# Altium schematic sheet DCMotor2CTRL.SchDoc
size B
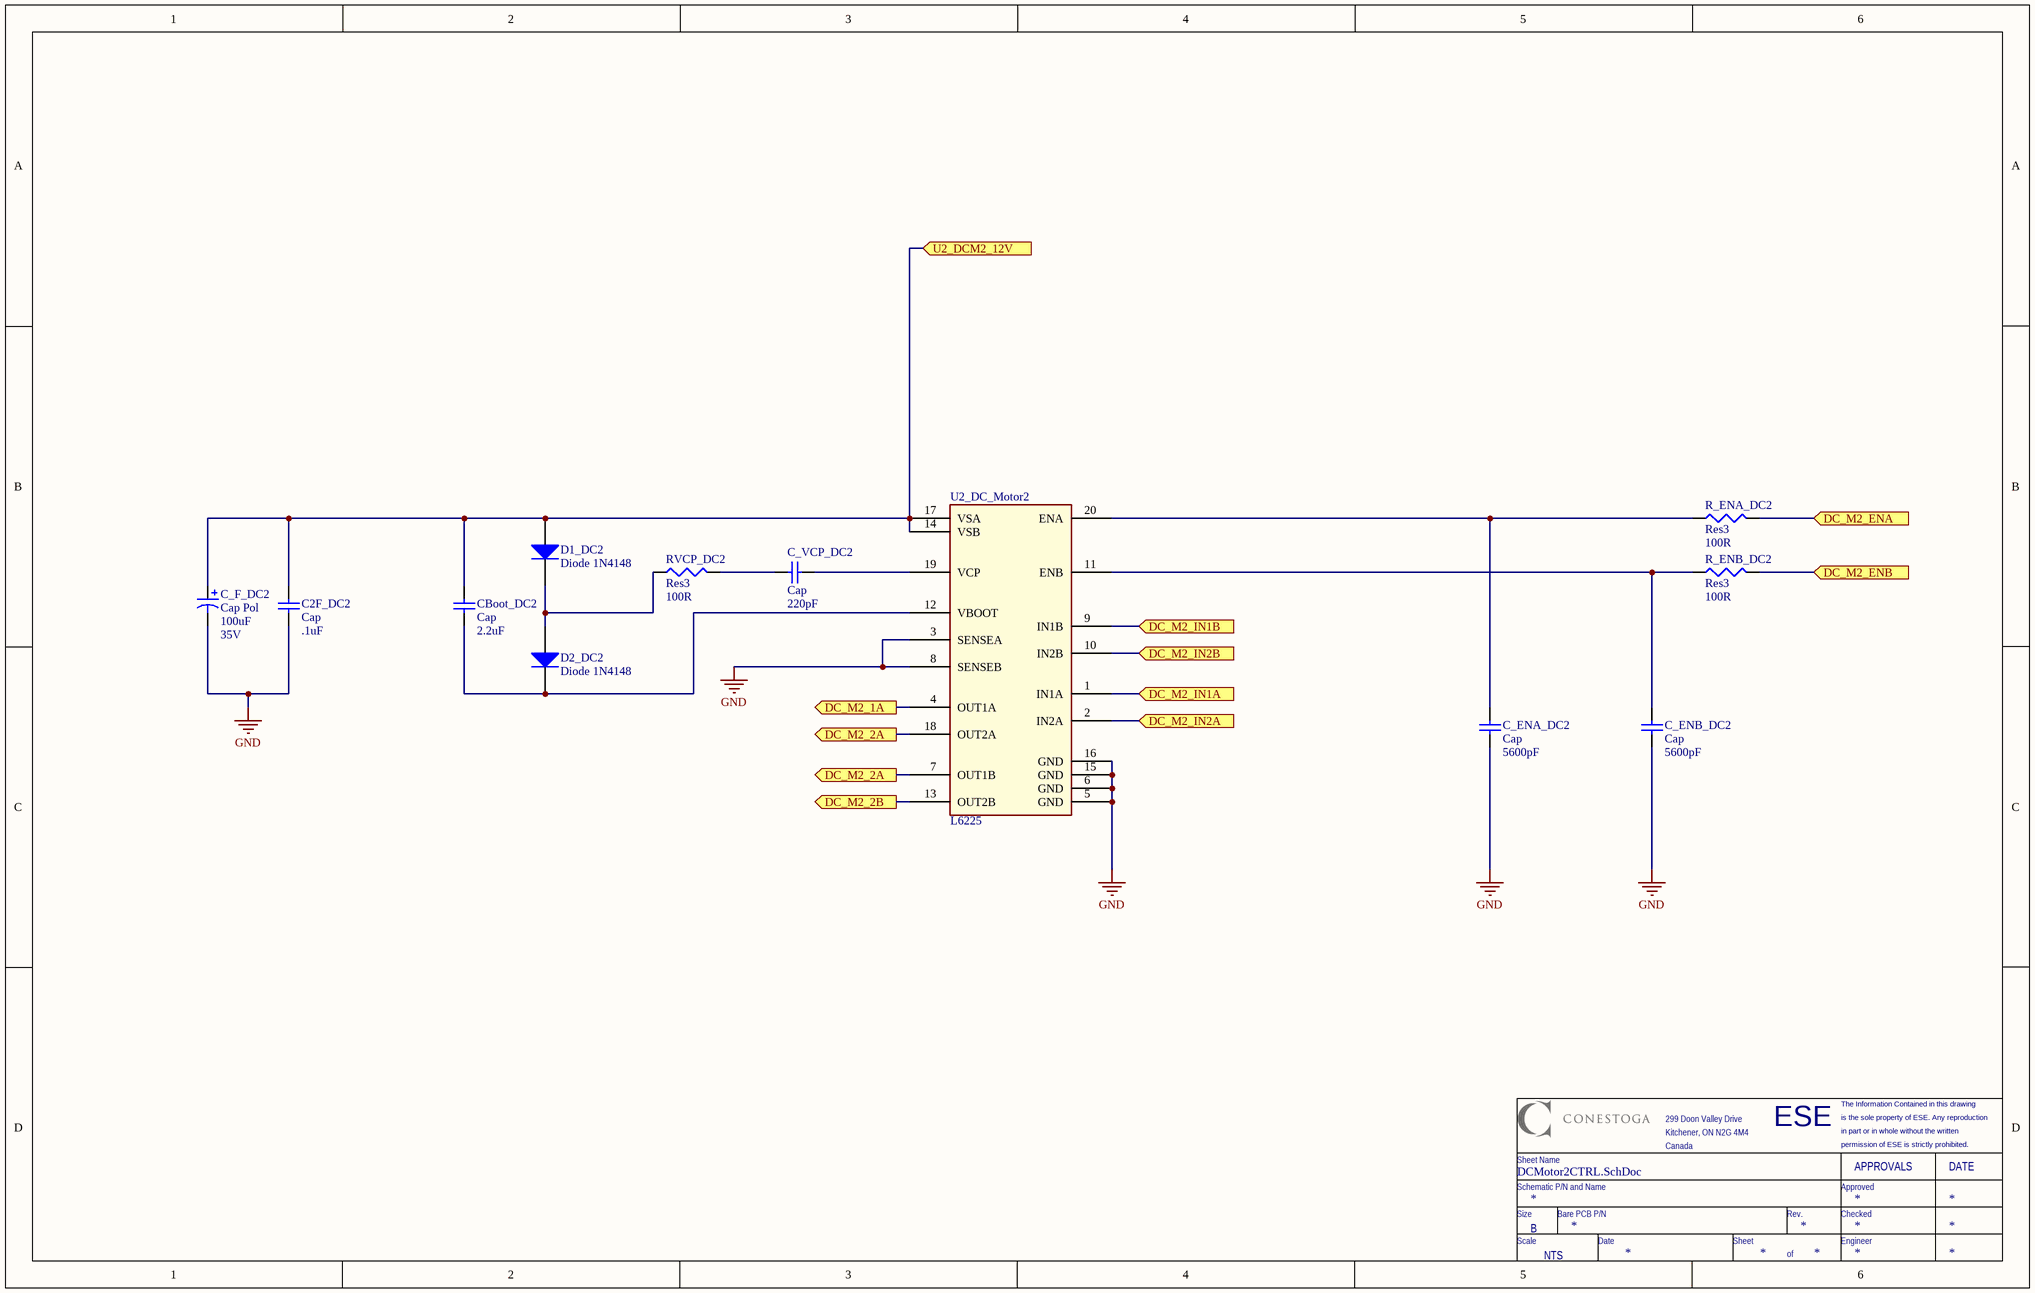
[diagram p0: DCMotor2CTRL.SchDoc]

## Parts
C2F_DC2  Cap  value .1uF  [CAPC2012X09M]
C_ENA_DC2  Cap  value 5600pF  [CAPC2012X09M]
C_ENB_DC2  Cap  value 5600pF  [CAPC2012X09M]
C_F_DC2  Cap Pol  value 100uF  Voltage: 35V  [CAPACITOR_6.3MM]
C_VCP_DC2  Cap  value 220pF  [CAPC2012X09M]
CBoot_DC2  Cap  value 2.2uF  [CAPC2012X09M]
D1_DC2  Diode 1N4148  [zener_sod323]
D2_DC2  Diode 1N4148  [zener_sod323]
R_ENA_DC2  Res3  value 100R  [RESC2112X05M]
R_ENB_DC2  Res3  value 100R  [RESC2112X05M]
RVCP_DC2  Res3  value 100R  [RESC2112X05M]
U2_DC_Motor2  L6225  [POWERSOP20]

## Ports
DC_M2_1A (out), DC_M2_2A (out), DC_M2_2B (out), DC_M2_ENA (in), DC_M2_ENB (in), DC_M2_IN1A (in), DC_M2_IN1B (in), DC_M2_IN2A (in), DC_M2_IN2B (in), U2_DCM2_12V (in)

## Nets
GND: C2F_DC2.1 C_ENA_DC2.1 C_ENB_DC2.1 C_F_DC2.2 U2_DC_Motor2.3(SENSEA) U2_DC_Motor2.5(GND) U2_DC_Motor2.6(GND) U2_DC_Motor2.8(SENSEB) U2_DC_Motor2.15(GND) U2_DC_Motor2.16(GND)
DC_M2_1A: U2_DC_Motor2.4(OUT1A) ; port DC_M2_1A
DC_M2_2A: U2_DC_Motor2.7(OUT1B) U2_DC_Motor2.18(OUT2A) ; port DC_M2_2A
DC_M2_2B: U2_DC_Motor2.13(OUT2B) ; port DC_M2_2B
DC_M2_ENA: R_ENA_DC2.2 ; port DC_M2_ENA
DC_M2_ENB: R_ENB_DC2.2 ; port DC_M2_ENB
DC_M2_IN1A: U2_DC_Motor2.1(IN1A) ; port DC_M2_IN1A
DC_M2_IN1B: U2_DC_Motor2.9(IN1B) ; port DC_M2_IN1B
DC_M2_IN2A: U2_DC_Motor2.2(IN2A) ; port DC_M2_IN2A
DC_M2_IN2B: U2_DC_Motor2.10(IN2B) ; port DC_M2_IN2B
U2_DCM2_12V: C2F_DC2.2 C_F_DC2.1 CBoot_DC2.2 D1_DC2.A U2_DC_Motor2.14(VSB) U2_DC_Motor2.17(VSA) ; port U2_DCM2_12V
NetC_ENA_DC2_2: C_ENA_DC2.2 R_ENA_DC2.1 U2_DC_Motor2.20(ENA)
NetC_ENB_DC2_2: C_ENB_DC2.2 R_ENB_DC2.1 U2_DC_Motor2.11(ENB)
NetC_VCP_DC2_1: C_VCP_DC2.1 RVCP_DC2.2
NetC_VCP_DC2_2: C_VCP_DC2.2 U2_DC_Motor2.19(VCP)
NetCBoot_DC2_1: CBoot_DC2.1 D2_DC2.K U2_DC_Motor2.12(VBOOT)
NetD1_DC2_K: D1_DC2.K D2_DC2.A RVCP_DC2.1

## Notes on the sheet
- ESE
- is the sole property of ESE. Any reproduction
- The Information Contained in this drawing
- Schematic P/N and Name
- Sheet Name
- 299 Doon Valley Drive
- Kitchener, ON N2G 4M4
- Canada
- Approved
- in part or in whole without the written
- permission of ESE is strictly prohibited.
- APPROVALS
- DATE
- Size
- Scale
- B
- NTS
- Bare PCB P/N
- Date
- Sheet
- Rev.
- Checked
- Engineer
- of

## Library data of the parts
C2F_DC2 = CAP-X7R-.1uF-100V-±10%: CAP CER .1uF 100v X7R 0805; MPN: C0805C104K1RACTU; PN: 399-3486-1-ND; Name: CAP-X7R-.1uF-100V-±10%; URL: http://www.digikey.ca/product-detail/en/C0805C104K1RACTU/399-3486-1-ND
C_ENA_DC2 C_ENB_DC2 = CAP-X7R-5600pF-50V-±10%: CAP CER 5600pF 50v X7R 0805; MPN: C0805C562K5RACTU; PN: 399-1156-1-ND; Name: CAP-X7R-5600pF-50V-±10%; URL: http://www.digikey.ca/product-detail/en/C0805C562K5RACTU/399-1156-1-ND
C_F_DC2 = Cap Polar-100uF-16V: CAP 85C 100uF ±20% 16V WX Series Aluminum Electrolytic; MPN: UWX1C101MCL1GB; Tan Theta: 0.16; Leakage Current: 16; Rated Ripple Current: 86; PN: 493-2105-1-ND; Name: Cap Polar-100uF-16V; Diameter: 6.3; URL: http://www.digikey.ca/product-detail/en/UWX1C101MCL1GB/493-2105-1-ND; URLZ: http://www.digikey.ca/product-detail/en/UWT1V101MCL1GS/493-2203-1-ND/590178
C_VCP_DC2 = CAP-COG-220pF-50V-±5%: CAP CER 220pF 50v COG 0805; MPN: C0805C221J5GACTU; PN: 399-1127-1-ND; Name: CAP-COG-220pF-50V-±5%; URL: http://www.digikey.ca/product-detail/en/C0805C221J5GACTU/399-1127-1-ND
CBoot_DC2 = CAP-X7R-2.2uF-16V-±10%: CAP CER 2.2uF 16v X7R 0805; MPN: C0805C225K4RACTU; PN: 399-3523-1-ND; Name: CAP-X7R-2.2uF-16V-±10%; URL: http://www.digikey.ca/product-detail/en/C0805C225K4RACTU/399-3523-1-ND
D1_DC2 D2_DC2 = Diode 1N4148: High Conductance Fast Diode; PN: 1N4148WXTPMSCT-ND; URL: http://www.digikey.ca/product-detail/en/1N4148WX-TP/1N4148WXTPMSCT-ND/717312
R_ENA_DC2 R_ENB_DC2 RVCP_DC2 = Resistor_100R: RES SMD 100R OHM 1% 1/8W 0805; MPN: CRCW0805100RFKEA; PN: 541-100CCT-ND; Name: Resistor_100R; URL: http://www.digikey.ca/product-detail/en/CRCW0805100RFKEA/541-100CCT-ND
U2_DC_Motor2 = L6225: IC MOTOR DRIVER PAR 20POWERSO; MPN: L6225PDTR; PN: 497-5345-1-ND; URL: http://www.digikey.ca/product-detail/en/L6225PDTR/497-5345-1-ND